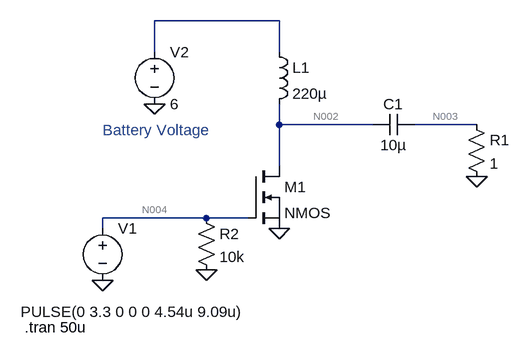
[diagram p0: schematic Draft1.asc]
Draft1.asc, the LTspice schematic file:
Version 4.1
SHEET 1 880 680
WIRE 272 -176 80 -176
WIRE 80 -128 80 -176
WIRE 272 -128 272 -176
WIRE 272 -16 272 -48
WIRE 416 -16 272 -16
WIRE 576 -16 480 -16
WIRE 272 48 272 -16
WIRE 160 128 0 128
WIRE 224 128 160 128
WIRE 0 144 0 128
FLAG 0 224 0
FLAG 80 -48 0
FLAG 272 144 0
FLAG 160 208 0
FLAG 576 64 0
SYMBOL voltage 0 128 R0
WINDOW 3 -126 144 Left 2
WINDOW 123 0 0 Left 0
WINDOW 39 0 0 Left 0
SYMATTR InstName V1
SYMATTR Value PULSE(0 3.3 0 0 0 4.54u 9.09u)
SYMBOL voltage 80 -144 R0
WINDOW 123 0 0 Left 0
WINDOW 39 0 0 Left 0
SYMATTR InstName V2
SYMATTR Value 6
SYMBOL ind 256 -144 R0
SYMATTR InstName L1
SYMATTR Value 220µ
SYMBOL cap 480 -32 R90
WINDOW 0 0 32 VBottom 2
WINDOW 3 32 32 VTop 2
SYMATTR InstName C1
SYMATTR Value 10µ
SYMBOL nmos 224 48 R0
SYMATTR InstName M1
SYMBOL res 144 112 R0
SYMATTR InstName R2
SYMATTR Value 10k
SYMBOL res 560 -32 R0
SYMATTR InstName R1
SYMATTR Value 1
TEXT 0 -8 Left 2 ;Battery Voltage
TEXT -120 296 Left 2 !.tran 50u

The netlist it stands for:
* Draft1.asc
V1 N004 0 PULSE(0 3.3 0 0 0 4.54u 9.09u)
V2 N001 0 6
L1 N001 N002 220µ
C1 N003 N002 10µ
M1 N002 N004 0 0 NMOS
R2 N004 0 10k
R1 N003 0 1
.model NMOS NMOS
.model PMOS PMOS
.lib standard.mos
* Battery Voltage
.tran 50u
.backanno
.end

* Results of the author's LTspice run, read from the files saved beside the schematic
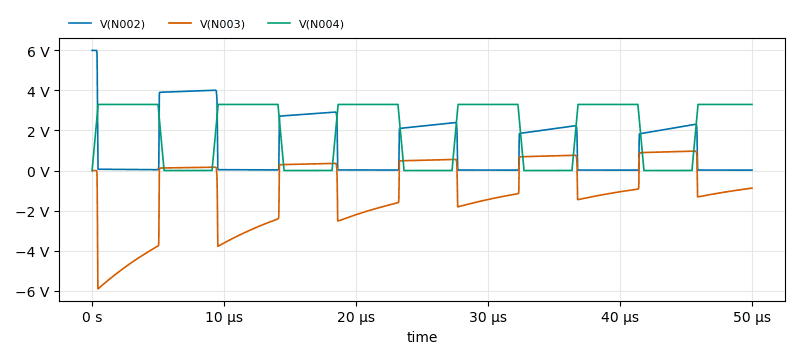
[diagram p1: Transient Analysis of Draft1.asc, plotted from the saved traces]
* Transient Analysis, 1 run:
*   V(N002): min 19.59 mV, max 6.001 V, average 1.226 V, rms 1.887 V, last 21.17 mV
*   V(N003): min -5.905 V, max 972.1 mV, average -1.021 V, rms 1.998 V, last -877.2 mV
*   V(N004): min 0 V, max 3.3 V, average 1.933 V, rms 2.49 V, last 3.3 V